# Altium schematic sheet Main.SchDoc
size A3
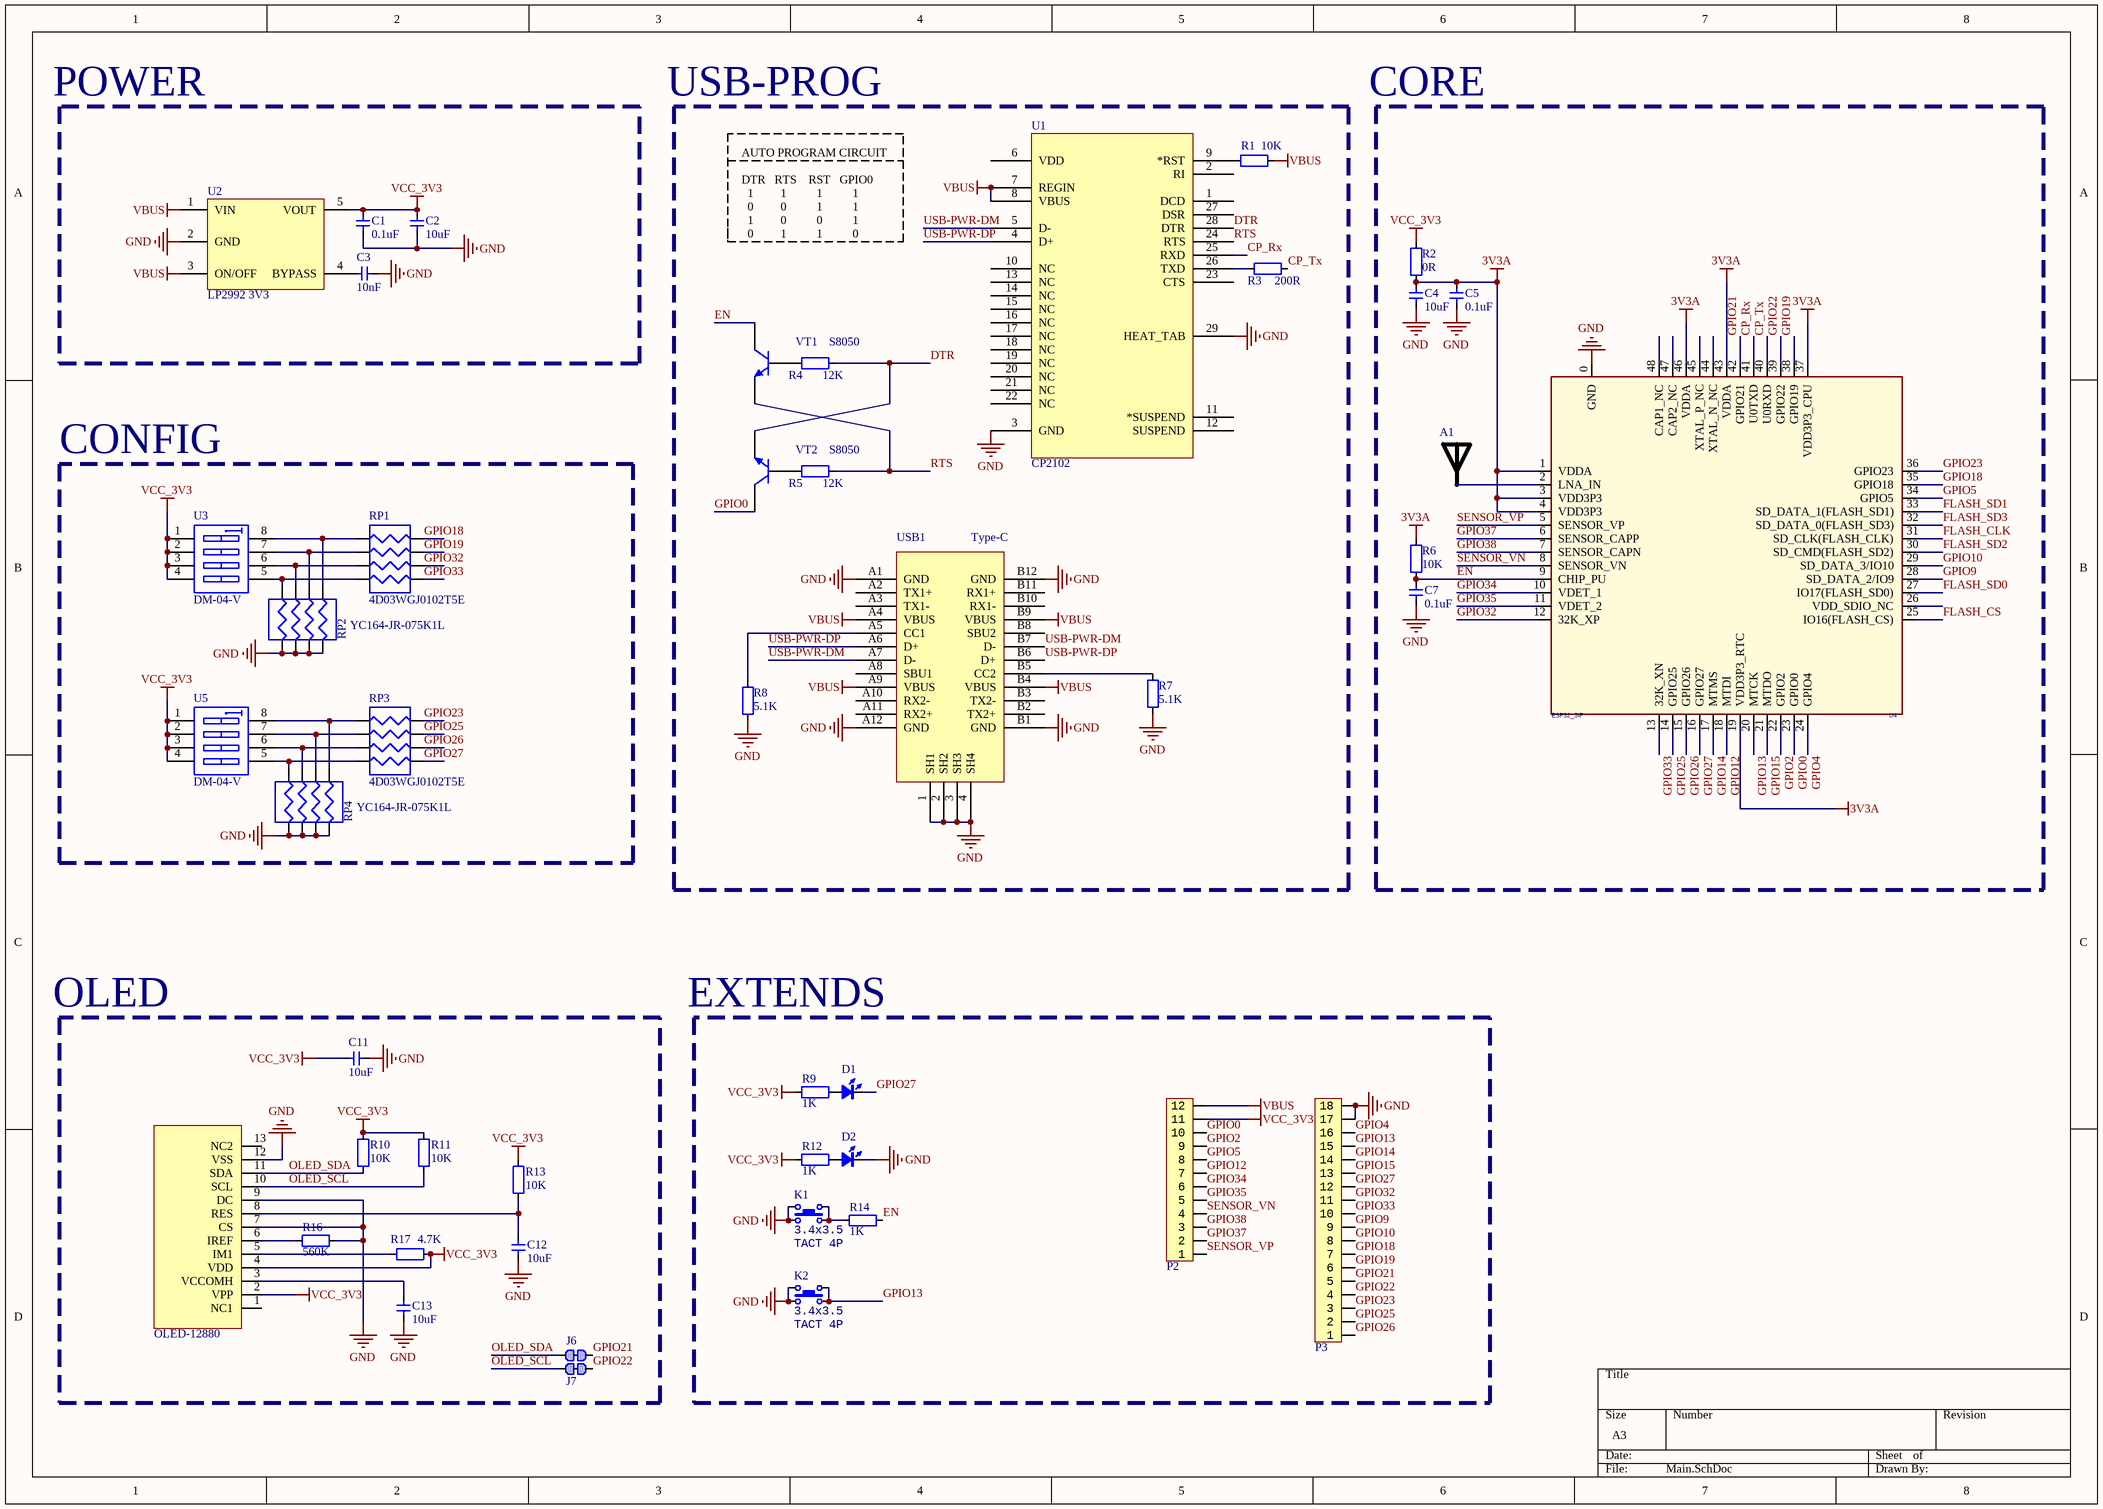
[diagram p0: Main.SchDoc]

## Parts
1  OLED-12880  [OLED-12880]
A1  RAINSUN  [ANT-Rainsun-AN5120]  (value not drawn)
C1  0.1uF  [CAP_0402]
C2  10uF  [CAP_0402]
C3  10nF  [CAP_0402]
C4  10uF  [CAP_0402]
C5  0.1uF  [CAP_0402]
C7  0.1uF  [CAP_0402]
C11  10uF  [CAP_0402]
C12  10uF  [CAP_0402]
C13  10uF  [CAP_0402]
D1  color?  [LED_0402_RED]  (value not drawn)
D2  color?  [LED_0402_RED]  (value not drawn)
J6  跳线  [0402-0R]  (value not drawn)
J7  跳线  [0402-0R]  (value not drawn)
K1  value 3.4x3.5  [ButtonTACT_3.5*3.55_90]  (hidden comment: TACT 4P)
K2  value 3.4x3.5  [ButtonTACT_3.5*3.55_90]  (hidden comment: TACT 4P)
P2  HDR1x12_2.54  [HDR1X12_2.54_180]  (value not drawn)
P3  HDR1x18_2.54  [HDR1X18_2.54_180]  (value not drawn)
R1  10K  [RES_0402]
R2  0R  [RES_0402]
R3  200R  [RES_0402]
R4  12K  [RES_0402]
R5  12K  [RES_0402]
R6  10K  [RES_0402]
R7  5.1K  [RES_0402]
R8  5.1K  [RES_0402]
R9  1K  [RES_0402]
R10  10K  [RES_0402]
R11  10K  [RES_0402]
R12  1K  [RES_0402]
R13  10K  [RES_0402]
R14  1K  [RES_0402]
R16  560K  [RES_0402]
R17  4.7K  [RES_0402]
RP1  4D03WGJ0102T5E  [RES-ARRAY-SMD_0603-8P-L3.2-W1.6-BL]
RP2  YC164-JR-075K1L  [RES-ARRAY-SMD_0603-8P-L3.2-W1.6-BL]
RP3  4D03WGJ0102T5E  [RES-ARRAY-SMD_0603-8P-L3.2-W1.6-BL]
RP4  YC164-JR-075K1L  [RES-ARRAY-SMD_0603-8P-L3.2-W1.6-BL]
U1  CP2102  [QFN-28]
U2  LP2992 3V3  [SOT23-5]
U3  DM-04-V  [SW-SMD_8P-L11.1-W6.2-P2.54-LS9.8]
U4  ESP32_SIP  [QFN-48_7X7]
U5  DM-04-V  [SW-SMD_8P-L11.1-W6.2-P2.54-LS9.8]
USB1  Type-C  [Type-C-TOP]
VT1  S8050  [SMT_TRIODE_NPN]
VT2  S8050  [SMT_TRIODE_NPN]

## Blocks framed on the sheet
CONFIG: RP1-RP4 U3 U5

## Nets
3V3A: C4.2 C5.2 R2.2 R6.1 U4.1(VDDA) U4.3(VDD3P3) U4.4(VDD3P3) U4.19(VDD3P3_RTC) U4.37(VDD3P3_CPU) U4.43(VDDA) U4.46(VDDA)
GND: 1.7(CS) 1.9(DC) 1.12(VSS) C1.1 C2.1 C3.1 C4.1 C5.1 C7.2 C11.1 C12.1 C13.1 D2.2(K) K1.1 K1.3 K2.1 K2.3 P3.17 P3.18 R7.2 R8.2 R16.2 RP2.5 RP2.6 RP2.7 RP2.8 RP4.5 RP4.6 RP4.7 RP4.8 U1.3(GND) U1.29(HEAT_TAB) U2.2(GND) U4.0(GND) USB1.1(SH1) USB1.2(SH2) USB1.3(SH3) USB1.4(SH4) USB1.A1(GND) USB1.A12(GND) USB1.B1(GND) USB1.B12(GND)
VBUS: P2.12 R1.1 U1.7(REGIN) U1.8(VBUS) U2.1(VIN) U2.3(ON/OFF) USB1.A4(VBUS) USB1.A9(VBUS) USB1.B4(VBUS) USB1.B9(VBUS)
VCC_3V3: 1.2(VPP) 1.4(VDD) C1.2 C2.2 C11.2 P2.11 R2.1 R9.1 R10.2 R11.2 R12.1 R13.2 R17.2 U2.5(VOUT) U3.1(A1) U3.2(A2) U3.3(A3) U3.4(A4) U5.1(A1) U5.2(A2) U5.3(A3) U5.4(A4)
CP_Rx: U1.25(RXD) U4.41(U0TXD)
CP_Tx: R3.1 U4.40(U0RXD)
DTR: R4.1 U1.28(DTR) VT2.2(E)
EN: C7.1 R6.2 R14.2 U4.9(CHIP_PU) VT1.3(C)
FLASH_CLK: U4.31(SD_CLK(FLASH_CLK))
FLASH_CS: U4.25(IO16(FLASH_CS))
FLASH_SD0: U4.27(IO17(FLASH_SD0))
FLASH_SD1: U4.33(SD_DATA_1(FLASH_SD1))
FLASH_SD2: U4.30(SD_CMD(FLASH_SD2))
FLASH_SD3: U4.32(SD_DATA_0(FLASH_SD3))
GPIO0: P2.10 U4.23(GPIO0) VT2.3(C)
GPIO2: P2.9 U4.22(GPIO2)
GPIO4: P3.16 U4.24(GPIO4)
GPIO5: P2.8 U4.34(GPIO5)
GPIO9: P3.9 U4.28(SD_DATA_2/IO9)
GPIO10: P3.8 U4.29(SD_DATA_3/IO10)
GPIO12: P2.7 U4.18(MTDI)
GPIO13: K2.2 K2.4 P3.15 U4.20(MTCK)
GPIO14: P3.14 U4.17(MTMS)
GPIO15: P3.13 U4.21(MTDO)
GPIO18: P3.7 RP1.8 U4.35(GPIO18)
GPIO19: P3.6 RP1.7 U4.38(GPIO19)
GPIO21: J6.2 P3.5 U4.42(GPIO21)
GPIO22: J7.2 P3.4 U4.39(GPIO22)
GPIO23: P3.3 RP3.8 U4.36(GPIO23)
GPIO25: P3.2 RP3.7 U4.14(GPIO25)
GPIO26: P3.1 RP3.6 U4.15(GPIO26)
GPIO27: D1.2(K) P3.12 RP3.5 U4.16(GPIO27)
GPIO32: P3.11 RP1.6 U4.12(32K_XP)
GPIO33: P3.10 RP1.5 U4.13(32K_XN)
GPIO34: P2.6 U4.10(VDET_1)
GPIO35: P2.5 U4.11(VDET_2)
GPIO37: P2.2 U4.6(SENSOR_CAPP)
GPIO38: P2.3 U4.7(SENSOR_CAPN)
OLED_SCL: 1.10(SCL) J7.1 R11.1
OLED_SDA: 1.11(SDA) J6.1 R10.1
RTS: R5.1 U1.24(RTS) VT1.2(E)
SENSOR_VN: P2.4 U4.8(SENSOR_VN)
SENSOR_VP: P2.1 U4.5(SENSOR_VP)
USB-PWR-DM: U1.5(D-) USB1.A7(D-) USB1.B7(D-)
USB-PWR-DP: U1.4(D+) USB1.A6(D+) USB1.B6(D+)
Net1_3: 1.3(VCCOMH) C13.2
Net1_5: 1.5(IM1) R17.1
Net1_6: 1.6(IREF) R16.1
Net1_8: 1.8(RES) C12.2 R13.1
NetA1_1: A1.1 U4.2(LNA_IN)
NetC3_2: C3.2 U2.4(BYPASS)
NetD1_1: D1.1(A) R9.2
NetD2_1: D2.1(A) R12.2
NetK1_2: K1.2 K1.4 R14.1
NetR1_2: R1.2 U1.9(*RST)
NetR3_2: R3.2 U1.26(TXD)
NetR4_2: R4.2 VT1.1(B)
NetR5_2: R5.2 VT2.1(B)
NetR7_1: R7.1 USB1.B5(CC2)
NetR8_1: R8.1 USB1.A5(CC1)
NetRP1_1: RP1.1 RP2.1 U3.8(B1)
NetRP1_2: RP1.2 RP2.2 U3.7(B2)
NetRP1_3: RP1.3 RP2.3 U3.6(B3)
NetRP1_4: RP1.4 RP2.4 U3.5(B4)
NetRP3_1: RP3.1 RP4.1 U5.8(B1)
NetRP3_2: RP3.2 RP4.2 U5.7(B2)
NetRP3_3: RP3.3 RP4.3 U5.6(B3)
NetRP3_4: RP3.4 RP4.4 U5.5(B4)

Not connected (* = marked no-connect by the designer): 1 1(NC1) 13(NC2); U1 1(DCD) 2(RI) 6(VDD) 10(NC) 11(*SUSPEND) 12(SUSPEND) 13(NC) 14(NC) 15(NC) 16(NC) 17(NC) 18(NC) 19(NC) 20(NC) 21(NC) 22(NC) 23(CTS) 27(DSR); U4 26(VDD_SDIO_NC) 44(XTAL_N_NC) 45(XTAL_P_NC) 47(CAP2_NC) 48(CAP1_NC); USB1 A2(TX1+) A3(TX1-) A8(SBU1) A10(RX2-) A11(RX2+) B2(TX2+) B3(TX2-) B8(SBU2) B10(RX1-) B11(RX1+)

## Notes on the sheet
- POWER
- USB-PROG
- CORE
- AUTO PROGRAM CIRCUIT
  DTR   RTS    RST   GPIO0
  1         1          1          1
  0         0          1          1
  1         0          0          1
  0         1          1          0
- OLED
- EXTENDS

## Library data of the parts
A1 = ANT-Rainsun-AP5120
C1-C5 C7 C11-C13 = 电容-0402: Capacitor; Value: 0.1u
D1 D2 = LED_0402: LED; Type: 0402; Value: color?
J6 J7 = 跳线: Resistor; Published: 8-Jun-2000; LatestRevisionDate: 17-Jul-2002; LatestRevisionNote: Re-released for DXP Platform.; PackageReference: AXIAL-0.4; Publisher: Altium Limited; PackageDescription: Axial Device, Thru-Hole; 2 Leads; 0.4 in Pin Spacing
K1 K2 = ButtonTACT: Button; type: TACT 4P
P2 = HDR1x12_2.54: Header
P3 = HDR1x18_2.54: Header
R1-R14 R16 R17 = 电阻-0402: Resistor; Value: 22R
RP1-RP4 = RP
U1 = CP2102: USB转TTL; PART DESC: SINGLE-CHIP USB TO UART BRIDGE, QFN28, RoHS.; MFG #1: SILICON LABS; PART NUMBER: CP2102; Value: Value; RefDes: RefDes; Type: DEV
U2 = LP2992: LDO
U3 U5 = SW DIP-4: DIP Switch, 4 Position, SPST; Published: 24-Mar-1999; LatestRevisionDate: 29-May-2009; LatestRevisionNote: IPC-7351 Footprint Added.; PackageVersion: Dec-2002; PackageReference: SO8; Publisher: Altium Limited; PackageDescription: 8-Pin Small Outline Integrated Circuit 1.27 mm Pitch; Code_JEDEC: MS-012-AA; Code_IPC: SOIC127P600-8
U4 = ESP32-PICO
USB1 = USB-Type-C-TOP
VT1 VT2 = SMT_TRIODE_NPN: Surface mount NPN transistor, package SOT-23